# EAGLE design logger_thruhole_2 (EAGLE 6.5.0)
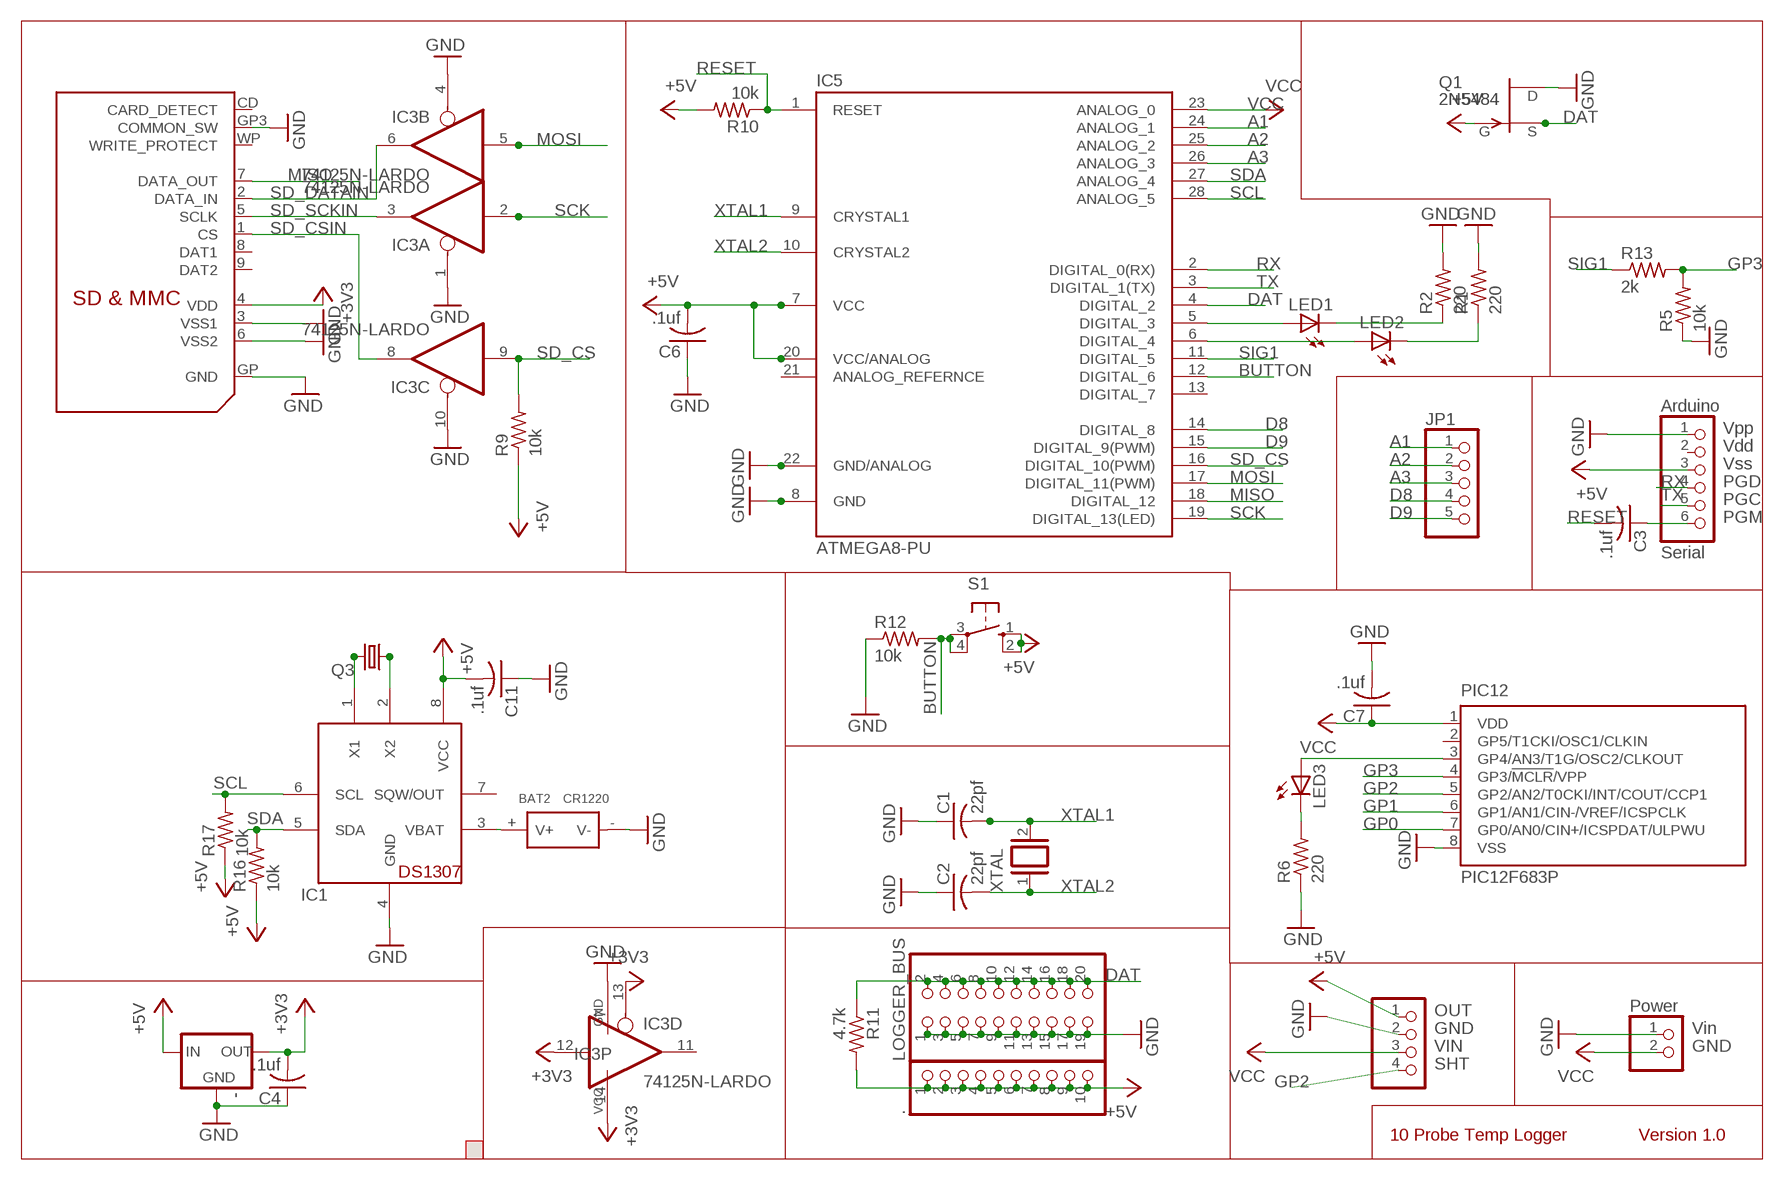
[diagram p0: schematic, sheet 1]

## Parts
'  MCP1700TRI  [TO92]
.  PINHD-1X10  [1X10]
BAT2  CR1220  SMD-BATTERY-CELL-HOLDER-PLASTIC  [BAT2P-SMD-16.4-CR1220]
C1  22pf  C-US025-025X050  [C025-025X050]
C2  22pf  C-US025-025X050  [C025-025X050]
C3  .1uf  C-US025-025X050  [C025-025X050]
C4  .1uf  C-US025-025X050  [C025-025X050]
C6  .1uf  C-US025-025X050  [C025-025X050]
C7  .1uf  C-US025-025X050  [C025-025X050]
C11  .1uf  C-US025-025X050  [C025-025X050]
IC1  DS1307  [DIL08]
IC3  74125N-LARDO  [DIL14-LARDO]
IC5  ATMEGA8-PU  [DIL28-3]
JP1  PINHD-1X5  [1X05]
JP2  PINHD-1X6  [1X06]
LED1  LEDLZR181  [LZR181]
LED2  LEDLZR181  [LZR181]
LED3  LEDLZR181  [LZR181]
LOGGER_BUS  PINHD-2X10  [2X10]
PIC12  PIC12F683P  [DIL8]
POWER  PINHD-1X2  [1X02]
Q1  2N5484  [TO92-]
Q3  CRYSTALTC38H  [TC38H]
R1  220  R-US_0207/2V  [0207/2V]
R2  220  R-US_0207/2V  [0207/2V]
R5  10k  R-US_0207/2V  [0207/2V]
R6  220  R-US_0207/2V  [0207/2V]
R9  10k  R-US_0207/2V  [0207/2V]
R10  10k  R-US_0207/2V  [0207/2V]
R11  4.7k  R-US_0207/2V  [0207/2V]
R12  10k  R-US_0207/2V  [0207/2V]
R13  2k  R-US_0207/2V  [0207/2V]
R16  10k  R-US_0207/2V  [0207/2V]
R17  10k  R-US_0207/2V  [0207/2V]
REG  PINHD-1X4  [1X04]
S1  10-XX  [B3F-10XX]
U$2  SDMMC06132  [06132]
XTAL  XTAL/S  [QS]

## Nets
+3V3: '.3(OUT) C4.2 IC3.12(D:I) IC3.13(D:OE) IC3.14(P:VCC) U$2.4(VDD)
+5V: '.2(IN) ..1 ..2 ..3 ..4 ..5 ..6 ..7 ..8 ..9 ..10 C6.2 C11.2 IC1.8(VCC) IC5.7(VCC) IC5.20(VCC/ANALOG) JP2.3 Q1.1(G) R9.1 R10.2 R11.2 R16.1 R17.1 REG.1 S1.1(S) S1.2(S1)
A1: IC5.24(ANALOG_1) JP1.1
A2: IC5.25(ANALOG_2) JP1.2
A3: IC5.26(ANALOG_3) JP1.3
BUTTON: IC5.12(DIGITAL_6) R12.2 S1.3(P) S1.4(P1)
D8: IC5.14(DIGITAL_8) JP1.4
D9: IC5.15(DIGITAL_9(PWM)) JP1.5
DAT: IC5.4(DIGITAL_2) LOGGER_BUS.2 LOGGER_BUS.4 LOGGER_BUS.6 LOGGER_BUS.8 LOGGER_BUS.10 LOGGER_BUS.12 LOGGER_BUS.14 LOGGER_BUS.16 LOGGER_BUS.18 LOGGER_BUS.20 Q1.2(S) R11.1
GND: '.1(GND) BAT2.-(V-) C1.1 C2.1 C4.1 C6.1 C7.2 C11.1 IC1.4(GND) IC3.1(A:OE) IC3.4(B:OE) IC3.7(P:GND) IC3.10(C:OE) IC5.8(GND) IC5.22(GND/ANALOG) JP2.1 LOGGER_BUS.1 LOGGER_BUS.3 LOGGER_BUS.5 LOGGER_BUS.7 LOGGER_BUS.9 LOGGER_BUS.11 LOGGER_BUS.13 LOGGER_BUS.15 LOGGER_BUS.17 LOGGER_BUS.19 PIC12.8(VSS) POWER.1 Q1.3(D) R1.2 R2.2 R5.1 R6.1 R12.1 REG.2 U$2.3(VSS1) U$2.6(VSS2) U$2.GP3(COMMON_SW) U$2.GP(GND)
GP0: PIC12.7(GP0/AN0/CIN+/ICSPDAT/ULPWU)
GP1: PIC12.6(GP1/AN1/CIN-/VREF/ICSPCLK)
GP2: PIC12.5(GP2/AN2/T0CKI/INT/COUT/CCP1) REG.4
GP3: PIC12.4(GP3/!MCLR!/VPP) R5.2 R13.2
MISO: IC5.18(DIGITAL_12) U$2.7(DATA_OUT)
MOSI: IC3.5(B:I) IC5.17(DIGITAL_11(PWM))
N$1: IC5.5(DIGITAL_3) LED1.A
N$2: BAT2.+(V+) IC1.3(VBAT)
N$3: IC5.6(DIGITAL_4) LED2.A
N$4: LED3.A PIC12.3(GP4/AN3/T1G/OSC2/CLKOUT)
N$5: IC1.1(X1) Q3.2
N$6: LED1.K(C) R2.1
N$7: IC1.2(X2) Q3.1
N$8: LED2.K(C) R1.1
N$9: LED3.K(C) R6.2
N$11: C3.1 JP2.6
RESET: C3.2 IC5.1(RESET) R10.1
RX: IC5.2(DIGITAL_0(RX)) JP2.4
SCK: IC3.2(A:I) IC5.19(DIGITAL_13(LED))
SCL: IC1.6(SCL) IC5.28(ANALOG_5) R17.2
SD_CS: IC3.9(C:I) IC5.16(DIGITAL_10(PWM)) R9.2
SD_CSIN: IC3.8(C:O) U$2.1(CS)
SD_DATAIN: IC3.6(B:O) U$2.2(DATA_IN)
SD_SCKIN: IC3.3(A:O) U$2.5(SCLK)
SDA: IC1.5(SDA) IC5.27(ANALOG_4) R16.2
SIG1: IC5.11(DIGITAL_5) R13.1
TX: IC5.3(DIGITAL_1(TX)) JP2.5
VCC: C7.1 IC5.23(ANALOG_0) PIC12.1(VDD) POWER.2 REG.3
XTAL1: C1.2 IC5.9(CRYSTAL1) XTAL.2
XTAL2: C2.2 IC5.10(CRYSTAL2) XTAL.1
Unconnected: IC1.7(SQW/OUT) IC3.11(D:O) IC5.13(DIGITAL_7) IC5.21(ANALOG_REFERNCE) JP2.2 PIC12.2(GP5/T1CKI/OSC1/CLKIN) U$2.8(DAT1) U$2.9(DAT2) U$2.CD(CARD_DETECT) U$2.WP(WRITE_PROTECT)

## Notes on the sheet
- 10 Probe Temp Logger | Version 1.0

## Library data of the parts
' = adafruit:MCP1700: VOLTAGE REGULATOR
. = pinhead:PINHD-1X10: PIN HEADER
BAT2 = Seeed-OPL-Connector:SMD-BATTERY-CELL-HOLDER-PLASTIC: 320170000
C1-C4 C6 C7 C11 = resistor:C-US: CAPACITOR, American symbol
IC1 = adafruit:DS1307: DS1307 Real time clock (RTC) with battery backup ability. Talk to it via i2c
IC3 = adafruit:74*125: Quad bus BUFFER, 3-state
IC5 = Arduino-AVR:ATMEGA8-PU
JP1 = pinhead:PINHD-1X5: PIN HEADER
JP2 = pinhead:PINHD-1X6: PIN HEADER
LED1-LED3 = led:LED: LED OSRAM: - CHIPLED LG R971, LG N971, LY N971, LG Q971, LY Q971, LO R971, LY R971 LH N974, LH R974 LS Q976, LO Q976, LY Q976 LO Q996 - Hyper CHIPLED LW Q18S LB Q993, LB Q99A, LB R99A - SideLED LS A670, LO A670, LY A670, LG A670, LP A670 LB A673, LV A673, LT A673, LW A673 LH A674 LY A675 LS A676, LA A676, LO A676, LY A676, LW A676 LS A679, LY A679, LG A679 - Hyper Micro SIDELED® LS Y876, LA Y876, LO Y876, LY Y876 LT Y87S - SmartLED LW L88C, LW L88S LB L89C, LB L89S, LG L890 LS L89K, LO L89K, LY L89K LS L896, LA L896, LO L896, LY L896 - TOPLED LS T670, LO T670, LY T670, LG T670, LP T670 LSG T670, LSP T670, LSY T670, LOP T670, LYG T670 LG T671, LOG T671, LSG T671 LB T673, LV T673, LT T673, LW T673 LH T674 LS T676, LA T676, LO T676, LY T676, LB T676, LH T676, LSB T676, LW T676 LB T67C, LV T67C, LT T67C, LS T67K, LO T67K, LY T67K, LW E67C LS E67B, LA E67B, LO E67B, LY E67B, LB E67C, LV E67C, LT E67C LW T67C LS T679, LY T679, LG T679 LS T770, LO T770, LY T770, LG T770, LP T770 LB T773, LV T773, LT T773, LW T773 LH T774 LS E675, LA E675, LY E675, LS T675 LS T776, LA T776, LO T776, LY T776, LB T776 LHGB T686 LT T68C, LB T68C - Hyper Mini TOPLED® LB M676 - Mini TOPLED Santana® LG M470 LS M47K, LO M47K, LY M47K Source: http://www.osram.convergy.de LUXEON: - LUMILED® LXK2-PW12-R00, LXK2-PW12-S00, LXK2-PW14-U00, LXK2-PW14-V00 LXK2-PM12-R00, LXK2-PM12-S00, LXK2-PM14-U00 LXK2-PE12-Q00, LXK2-PE12-R00, LXK2-PE12-S00, LXK2-PE14-T00, LXK2-PE14-U00 LXK2-PB12-K00, LXK2-PB12-L00, LXK2-PB12-M00, LXK2-PB14-N00, LXK2-PB14-P00, LXK2-PB14-Q00 LXK2-PR12-L00, LXK2-PR12-M00, LXK2-PR14-Q00, LXK2-PR14-R00 LXK2-PD12-Q00, LXK2-PD12-R00, LXK2-PD12-S00 LXK2-PH12-R00, LXK2-PH12-S00 LXK2-PL12-P00, LXK2-PL12-Q00, LXK2-PL12-R00 Source: www.luxeon.com KINGBRIGHT: KA-3528ASYC Source: www.kingbright.com
LOGGER_BUS = pinhead:PINHD-2X10: PIN HEADER
PIC12 = microchip:PIC12F683: 8-Pin Flash-Based, 8-Bit CMOS Microcontrollers with nanoWatt Technology Source: http://ww1.microchip.com/downloads/en/DeviceDoc/41211D_.pdf; MF: MICROCHIP; MPN: PIC12F683-I/P; OC_FARNELL: 9759034; OC_NEWARK: 89H0442
POWER = pinhead:PINHD-1X2: PIN HEADER
Q1 = transistor-fet:?548*: N-Channel JFETs Source: VISHAY 2N5484.pdf Compatible: TO92 2N5245 J304 J305 U310 J308 J309 J310 TO72 2N4416 2N4416A 2N3823 2N4351 3N169 3N170 3N171 MFE3002 TO18 2N3796 2N3797 MFE825 Source: Motorola European Master Guide Pacge 3-59
Q3 = adafruit:CRYSTAL: CRYSTAL; OC_FARNELL: unknown; OC_NEWARK: unknown
R1 R2 R5 R6 R9-R13 R16 R17 = rcl:R-US_: RESISTOR, American symbol
REG = pinhead:PINHD-1X4: PIN HEADER
S1 = switch-omron:10-XX: OMRON SWITCH; MPN: B3F-1000; OC_FARNELL: 176432; OC_NEWARK: 36M3542
U$2 = adafruit:SDMMC: SD MMC Card holder 4UCON part #06132 - easy to solder
XTAL = special:XTAL/S: CRYSTAL

## Board
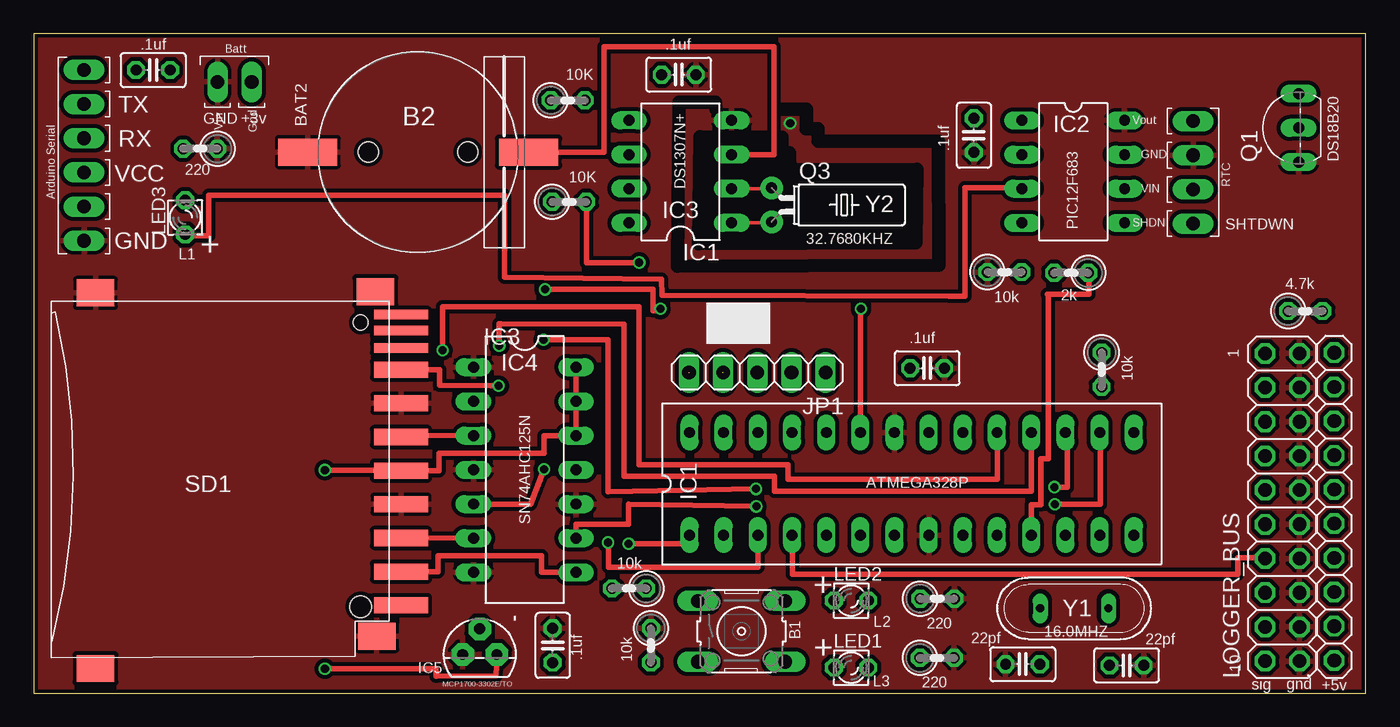
[diagram p1: board, top side]
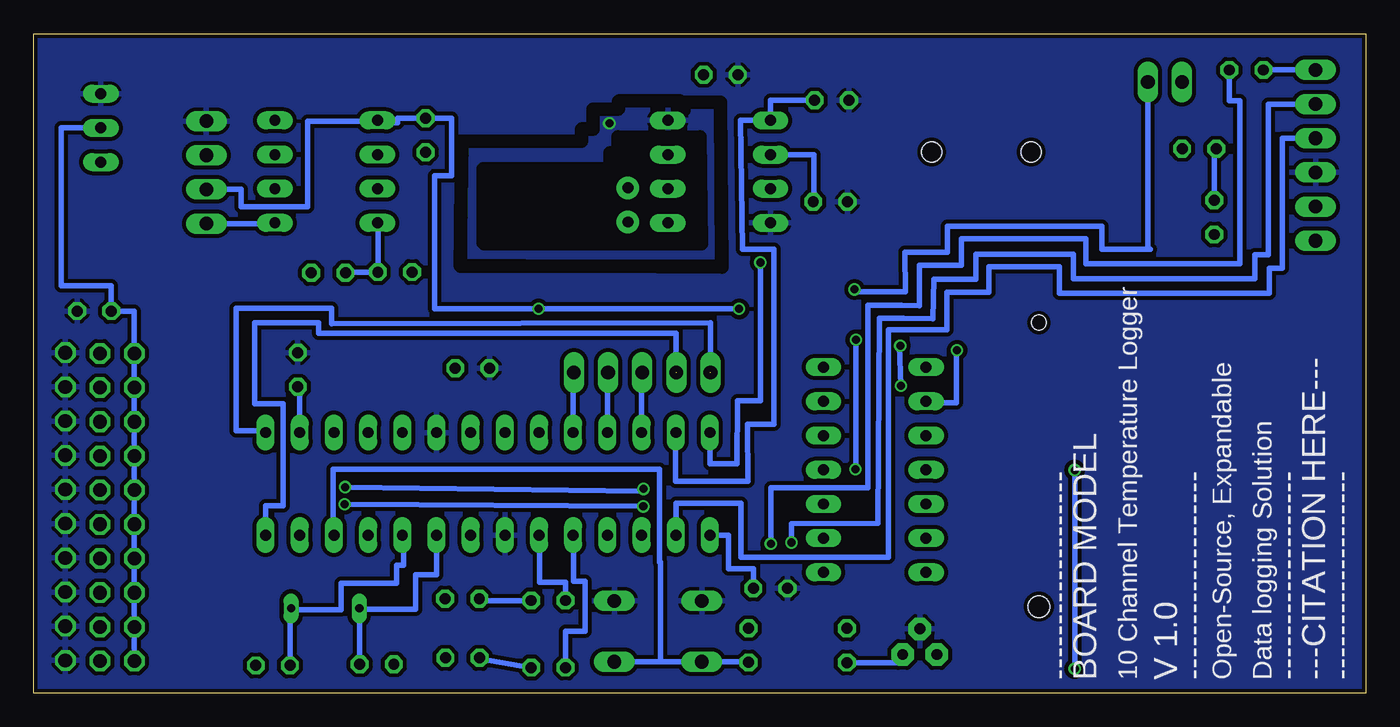
[diagram p2: board, bottom side, seen from below]

Size 99 x 49 mm. Coordinates in mm from the lower left corner, seen from the top.
Outline: 0,0 99,0 99,49 0,49 0,0
Copper layers (1*16): Top 0.035mm / dielectric 1.5mm / Bottom 0.035mm
Design rules "Fusion_eagle_rule_v1.1": minimum track width 6mil, minimum drill 12mil, track to track 6mil, track to pad 6mil, pad to pad 6mil, via to via 6mil, smd to smd 0mil, copper to edge 10mil, drill to drill 10mil, minimum pad ring 10mil, minimum via ring 6mil, stop-mask expansion 2mil, vias tented up to drill 100mil, thermal gap 10mil
tRestrict: area 49.4,33.4 to 65.6,41.3; area 47.9,31.7 to 67.3,43.9
bRestrict: area 47.9,31.7 to 67.3,43.9; area 51,43.4 to 55.5,44; area 49.4,33.4 to 65.6,41.3

### Footprints (pad centres in the part's own frame; a part is rotated, then mirrored left to right if it is on the bottom)
TO92 = drill 0.813 pad 1.676 octagon: 1 -1.27,0; 2 0,1.905; 3 1.27,0
1X10 = drill 1.016 octagon: 1 -11.43,0; 2 -8.89,0; 3 -6.35,0; 4 -3.81,0; 5 -1.27,0; 6 1.27,0; 7 3.81,0; 8 6.35,0; 9 8.89,0; 10 11.43,0
BAT2P-SMD-16.4-CR1220 = smd 2 x 4.4: + 0,-8.2; - 0,8.2 | hole 1.5: 0,3.7; 0,-3.7
C025-025X050 = drill 0.813 octagon: 1 -1.27,0; 2 1.27,0
DIL08 = drill 0.813 long: 1 -3.81,-3.81; 2 -1.27,-3.81; 3 1.27,-3.81; 4 3.81,-3.81; 5 3.81,3.81; 6 1.27,3.81; 7 -1.27,3.81; 8 -3.81,3.81
DIL14-LARDO = drill 0.813 long: 1 -7.62,-3.81; 2 -5.08,-3.81; 3 -2.54,-3.81; 4 0,-3.81; 5 2.54,-3.81; 6 5.08,-3.81; 7 7.62,-3.81; 8 7.62,3.81; 9 5.08,3.81; 10 2.54,3.81; 11 0,3.81; 12 -2.54,3.81; 13 -5.08,3.81; 14 -7.62,3.81
DIL28-3 = drill 0.813 long: 1 -16.51,-3.81; 2 -13.97,-3.81; 3 -11.43,-3.81; 4 -8.89,-3.81; 5 -6.35,-3.81; 6 -3.81,-3.81; 7 -1.27,-3.81; 8 1.27,-3.81; 9 3.81,-3.81; 10 6.35,-3.81; 11 8.89,-3.81; 12 11.43,-3.81; 13 13.97,-3.81; 14 16.51,-3.81; 15 16.51,3.81; 16 13.97,3.81; 17 11.43,3.81; 18 8.89,3.81; 19 6.35,3.81; 20 3.81,3.81; 21 1.27,3.81; 22 -1.27,3.81; 23 -3.81,3.81; 24 -6.35,3.81; 25 -8.89,3.81; 26 -11.43,3.81; 27 -13.97,3.81; 28 -16.51,3.81
1X05 = drill 1.016 long: 1 -5.08,0; 2 -2.54,0; 3 0,0; 4 2.54,0; 5 5.08,0
1X06 = drill 1.016 long: 1 -6.35,0; 2 -3.81,0; 3 -1.27,0; 4 1.27,0; 5 3.81,0; 6 6.35,0
LZR181 = drill 0.813 octagon: A -1.27,0; K 1.27,0
2X10 = drill 1.016 octagon: 1 -11.43,-1.27; 2 -11.43,1.27; 3 -8.89,-1.27; 4 -8.89,1.27; 5 -6.35,-1.27; 6 -6.35,1.27; 7 -3.81,-1.27; 8 -3.81,1.27; 9 -1.27,-1.27; 10 -1.27,1.27; 11 1.27,-1.27; 12 1.27,1.27; 13 3.81,-1.27; 14 3.81,1.27; 15 6.35,-1.27; 16 6.35,1.27; 17 8.89,-1.27; 18 8.89,1.27; 19 11.43,-1.27; 20 11.43,1.27
DIL8 = drill 0.813 long: 1 -3.81,-3.81; 2 -1.27,-3.81; 3 1.27,-3.81; 4 3.81,-3.81; 5 3.81,3.81; 6 1.27,3.81; 7 -1.27,3.81; 8 -3.81,3.81
1X02 = drill 1.016 long: 1 -1.27,0; 2 1.27,0
TO92- = drill 0.813 long: 1 2.54,0; 2 0,0; 3 -2.54,0
TC38H = drill 0.813 pad 1.676: 1 -1.27,0; 2 1.27,0
0207/2V = drill 0.813 octagon: 1 -1.27,0; 2 1.27,0
1X04 = drill 1.016 long: 1 -3.81,0; 2 -1.27,0; 3 1.27,0; 4 3.81,0
B3F-10XX = drill 1.016 long: 1 -3.251,2.261; 2 3.251,2.261; 3 -3.251,-2.261; 4 3.251,-2.261
06132 = smd 1.2 x 4: 1 6.9,0.9; 2 4.4,0.9; 3 1.9,0.9; 4 -0.6,0.9; 5 -3.1,0.9; 6 -5.6,0.9; 7 -8.1,0.9; 9 9.4,0.9 | smd 0.7 x 4: 8 -9.7,0.9; CD -11,0.9; WP -12.2,0.9 | smd 2 x 2.8: GP -13.8,-21.8; GP2 14.1,-21.8; GP3 11.7,-0.9; GP4 -13.9,-1 | hole 1.1: -11.6,-2.1 | hole 1.6: 9.5,-2.1
QS = drill 0.61 long: 1 -2.54,0; 2 2.54,0

### Placement (x,y rotation side)
'  33.15,2.88 0 top
.  96.65,13.87 90 top
BAT2  28.57,40.2 90 top
C1  73.5,2.16 0 top
C2  81.22,2.07 180 top
C3  8.88,46.3 0 top
C4  38.57,3.55 270 top
C6  66.4,24.15 180 top
C7  69.87,41.45 270 top
C11  47.94,45.95 180 top
IC1  48.06,38.75 90 top
IC3  36.49,16.6 270 top
IC5  65.25,15.56 0 top
JP1  53.77,23.82 180 top
JP2  3.74,39.96 90 top
LED1  60.75,1.91 0 top
LED2  60.75,6.89 0 top
LED3  11.27,35.35 90 top
LOGGER_BUS  92.79,13.82 90 top
PIC12  77.26,38.75 270 top
POWER  14.93,45.42 0 top
Q1  94,42 90 top
Q3  54.84,36.28 270 top
R1  67.15,7.03 0 top
R2  67.13,2.63 0 top
R5  72.15,31.29 0 top
R6  12.38,40.45 180 top
R9  79.37,24.04 270 top
R10  44.25,7.79 180 top
R11  94.5,28.39 0 top
R12  45.87,3.56 270 top
R13  77.1,31.23 180 top
R16  39.69,44.05 0 top
R17  39.8,36.51 0 top
REG  86.17,38.7 270 top
S1  52.6,4.6 0 top
U$2  26.4,15.94 270 top
XTAL  77.33,6.31 180 top

### Tracks (layer width: path | path; a pad name or v marks a point on that pad's centre or on a via)
+3V3  (via drill 0.6)
  Top 0.406: IC3.14 IC3.13 IC3.12 37.92,19.14 37.92,17.84 30.12,17.84 30.12,16.54 U$2.4 27.3,16.58 v21.64,16.58 | '.3 34.38,1.32 29.9,1.28 29.9,1.82 v21.64,1.82
  Bottom 0.406: '.3 34.42,2.28 C4.2 38.57,2.23 | v21.64,1.82 v21.64,16.58
+5V
  pour Bottom (isolate 0.305, rank 2): 0,49 99,49 99,0 0,0
A1
  Bottom 0.406: JP1.1 58.9,23.82 IC5.24
A2
  Bottom 0.406: JP1.2 56.36,23.82 IC5.25
A3
  Bottom 0.406: JP1.3 53.82,23.82 IC5.26
BUTTON
  Bottom 0.406: S1.4 52.42,2.34 | 52.42,2.34 S1.3 45.87,2.34 R12.2 | IC5.12 76.76,11.75 76.76,16.66 52.5,16.66 52.5,9.74 52.42,9.74 52.42,2.34
D8  (1 unrouted)
  Bottom 0.406: JP1.4 51.26,26.76 77.82,26.76 77.82,27.52 82.56,27.52 82.56,21.52 80.46,21.52 80.46,13.94 81.76,13.94 IC5.14
D9  (1 unrouted)
  Bottom 0.406: 48.72,23.83 48.7,27.52 76.84,27.44 76.84,28.62 83.94,28.62 83.94,19.5 81.76,19.5 IC5.15
DAT
  Top 0.406: IC5.4 56.38,11.75 56.38,8.84 89.5,8.84 89.5,10.06 91.52,10.06 LOGGER_BUS.8
  Bottom 0.406: LOGGER_BUS.2 LOGGER_BUS.4 LOGGER_BUS.6 LOGGER_BUS.8 LOGGER_BUS.10 LOGGER_BUS.12 LOGGER_BUS.14 LOGGER_BUS.16 LOGGER_BUS.18 LOGGER_BUS.20 91.52,28.39 R11.1 93.23,30.26 96.96,30.26 96.96,42 Q1.2
GND  (via drill 0.6)
  other vias: 56.22,42.34
  pour Top (isolate 0.305, rank 2): 0,49 99,49 99,0 0,0
  pour Bottom (isolate 0.305): 48,44 47.9,31.64 67.22,31.64 67.22,41 58.28,41 58.28,41.96 57.52,41.96 57.52,41.84 57.42,41.84 57.42,43.34 55.54,43.46 55.46,43.46 55.46,44.06 47.92,44.06 47.92,43.96
GP2
  Bottom 0.406: PIC12.5 81.07,34.89 REG.4
GP3
  Bottom 0.406: PIC12.4 73.42,34.94 R5.2 75.83,31.29 R13.2
MISO  (via drill 0.6)
  Top 0.406: U$2.7 30.16,24.04 30.16,22.88 34,22.85 | 34,22.85 v34.56,22.84 34,22.84 34,22.85 | IC5.18 74.16,19.37 74.16,15 55.04,15 55.04,16.14 43.86,16.14 43.86,27.4 34.68,27.44 34.6,27.44 v34.6,25.82
  Bottom 0.406: v34.6,25.82 34.66,25.82 v34.56,22.84
MOSI  (via drill 0.6)
  Top 0.406: IC3.5 36.92,14.06 v37.92,16.64 | 76.76,19.37 IC5.17 76.8,19.37 76.8,15.32 v75.86,15.32 | v53.68,15.18 42.68,14.98 42.68,26.26 v37.9,26.26
  Bottom 0.406: 37.88,16.64 v37.92,16.64 37.9,16.64 v37.9,26.26 | v75.86,15.32 53.7,15 v53.68,15.18
N$1
  Bottom 0.406: IC5.5 58.88,11.75 58.88,8.32 58.02,8.32 58.02,4.6 59.46,4.6 LED1.A
N$2
  Top 0.406: BAT2.+ 42.4,40.2 42.4,48.02 55.02,48.02 55.02,40.02 IC1.3
N$3
  Bottom 0.406: IC5.6 61.42,11.75 61.42,8.26 59.48,8.26 LED2.A
N$4
  Top 0.406: LED3.A 11.27,34 13,34 13,37 35,37 35,31 35,30.9 46.66,30.74 46.68,29.56 68.04,29.5 69.22,29.5 69.22,37.56 73.45,37.56 PIC12.3
N$5
  Top 0.254: IC1.1 54.84,34.94 Q3.2
N$6
  Bottom 0.406: LED1.K 65.86,2.57 R2.1
N$7
  Top 0.254: IC1.2 54.84,37.48 Q3.1
N$8
  Bottom 0.406: LED2.K 65.88,6.89 R1.1
N$9
  Bottom 0.406: R6.2 11.27,40.45 LED3.K
N$11
  Bottom 0.406: JP2.6 C3.1
RESET  (via drill 0.6)
  Top 0.406: v44.22,11.1 48.74,11.1 IC5.1
  Bottom 0.406: IC5.1 47.36,11.75 47.36,9.24 45.52,9.24 R10.1 | v44.22,11.1 44.22,15.28 37,15.28 37,28.82 34.5,28.82 33.16,28.8 33.16,31.78 30.04,31.78 30.04,33.78 20.8,33.78 20.8,31.9 9.36,31.9 9.36,44 10.15,44 C3.2
RX
  Bottom 0.406: JP2.4 6.2,41.23 6.2,31.58 7.18,31.58 7.18,29.72 22.78,29.72 22.78,31.7 28,31.7 28,29.8 31.12,29.8 31.14,27 34.24,27.02 35.48,27.02 35.46,10.1 46.44,10.1 46.44,14.1 51.28,14.1 IC5.2
SCK  (via drill 0.6)
  Top 0.406: IC5.19 71.62,19.37 71.62,15.9 56.04,15.9 56.04,16.98 45,16.98 45,28.7 30.38,28.7 v30.38,25.48
  Bottom 0.406: v30.38,25.48 30.42,25.48 30.42,21.6 32.68,21.6 IC3.2
SCL  (via drill 0.6)
  Top 0.406: v45,32 41.07,32 R17.2
  Bottom 0.406: IC5.28 48.74,17.04 46.74,17.04 46.68,21.72 45,21.72 | R17.2 41,36.51 41,40 44.25,40 IC1.6 | 44.98,21.72 45,21.72 | 45,21.72 v45,32
SD_CS  (via drill 0.6)
  Top 0.406: IC5.16 79.26,19.37 79.26,14.04 v75.88,14.04 | v53.7,13.88 44.2,14.06 44.2,12.54 40.3,12.54 IC3.9
  Bottom 0.406: R9.2 79.22,22.77 IC5.16 | v75.88,14.04 v53.7,13.88
SD_CSIN
  Top 0.406: U$2.1 30.06,9.04 30.06,10.22 37.76,10.22 37.76,9 39.98,9 IC3.8
SD_DATAIN
  Top 0.406: U$2.2 27.3,11.56 IC3.6
SD_SCKIN
  Top 0.406: U$2.5 27.3,19.18 IC3.3
SDA
  Bottom 0.406: IC5.27 51.3,19.37 51.3,15.74 45.92,15.74 45.94,19.98 44,20 44,33 46.34,33 46.48,42.56 IC1.5 44.25,44.05 R16.2
SIG1
  Top 0.406: R13.1 78.42,31.23 78.42,29.66 75.4,29.66 | IC5.11 74.14,14 74.84,14 74.84,17.42 75.4,17.42 75.4,29.66 | 75.34,29.66 75.4,29.66
TX  (via drill 0.6)
  Top 0.406: v42.68,11.2 42.72,11.2 42.72,9.36 53.82,9.36 IC5.3
  Bottom 0.406: JP2.5 7.26,43.77 7.26,32.56 8.26,32.56 8.26,30.78 21.72,30.78 21.72,32.6 28.98,32.6 28.98,30.74 32.1,30.74 32.16,27.82 34.38,27.86 36.16,27.86 36.24,12.62 42.68,12.6 v42.68,11.2
VCC  (via drill 0.6)
  Top 0.406: v38,30 46.02,30 46.02,28.42 46.58,28.42 v46.58,28.56 | IC5.23 61.44,28.56 v61.48,28.56
  Bottom 0.406: REG.3 83.56,37.43 83.56,36.14 78.64,36.14 78.64,42.5 73.45,42.5 PIC12.1 73.45,42.38 71.94,42.38 71.94,42.72 C7.1 67.94,42.72 67.94,38.44 69.22,38.44 69.22,28.56 v61.48,28.56 v46.58,28.56 | 16.2,33 19.62,33 19.62,34.7 31.08,34.7 31.08,32.76 34.24,32.76 34.2,29.82 38,29.82 v38,30 | 16,33 16.2,33 | 16.2,33 POWER.2
XTAL1
  Bottom 0.406: IC5.9 69.04,11.75 69.04,8.8 70.6,8.8 70.6,6.26 74.77,6.26 | XTAL.2 74.8,6.26 74.77,6.26 | 74.77,6.26 C1.2
XTAL2
  Bottom 0.406: IC5.10 71.5,11.75 71.5,9.52 72.04,9.52 72.04,8.16 76.14,8.16 76.14,6.2 79.88,6.2 | 79.88,6.2 XTAL.1 | 79.88,6.2 79.95,6.2 C2.2

### Text on the board
tPlace: .1uf | .1uf | 10K | +3v | GND | B2 | IC2 | .1uf | DS18B20 | VCC | 220 | 10K | IC3 | DS1307N+ | Y2 | PIC12F683 | SHTDWN | GND | 32.7680KHZ | L1 | + | 4.7k | 10k | 2k | .1uf | 1 | IC4 | 10k | SD1 | ATMEGA328P | IC1 | SN74AHC125N | 10k | + | Y1 | L2 | 220 | B1 | 22pf | 16.0MHZ | 22pf | + | .1uf | 10k | 10 | IC5 | MCP1700-3302E/TO | L3 | 220 | sig | gnd | +5v
bPlace: ------------------- | ---CITATION HERE--- | ------------------- | Data logging Solution | Open-Source, Expandable | ------------------- | V 1.0 | 10 Channel Temperature Logger | BOARD MODEL | -------------------